# Altium schematic sheet Main.SchDoc
size A2; SheetNumber: 1; SheetTotal: 3
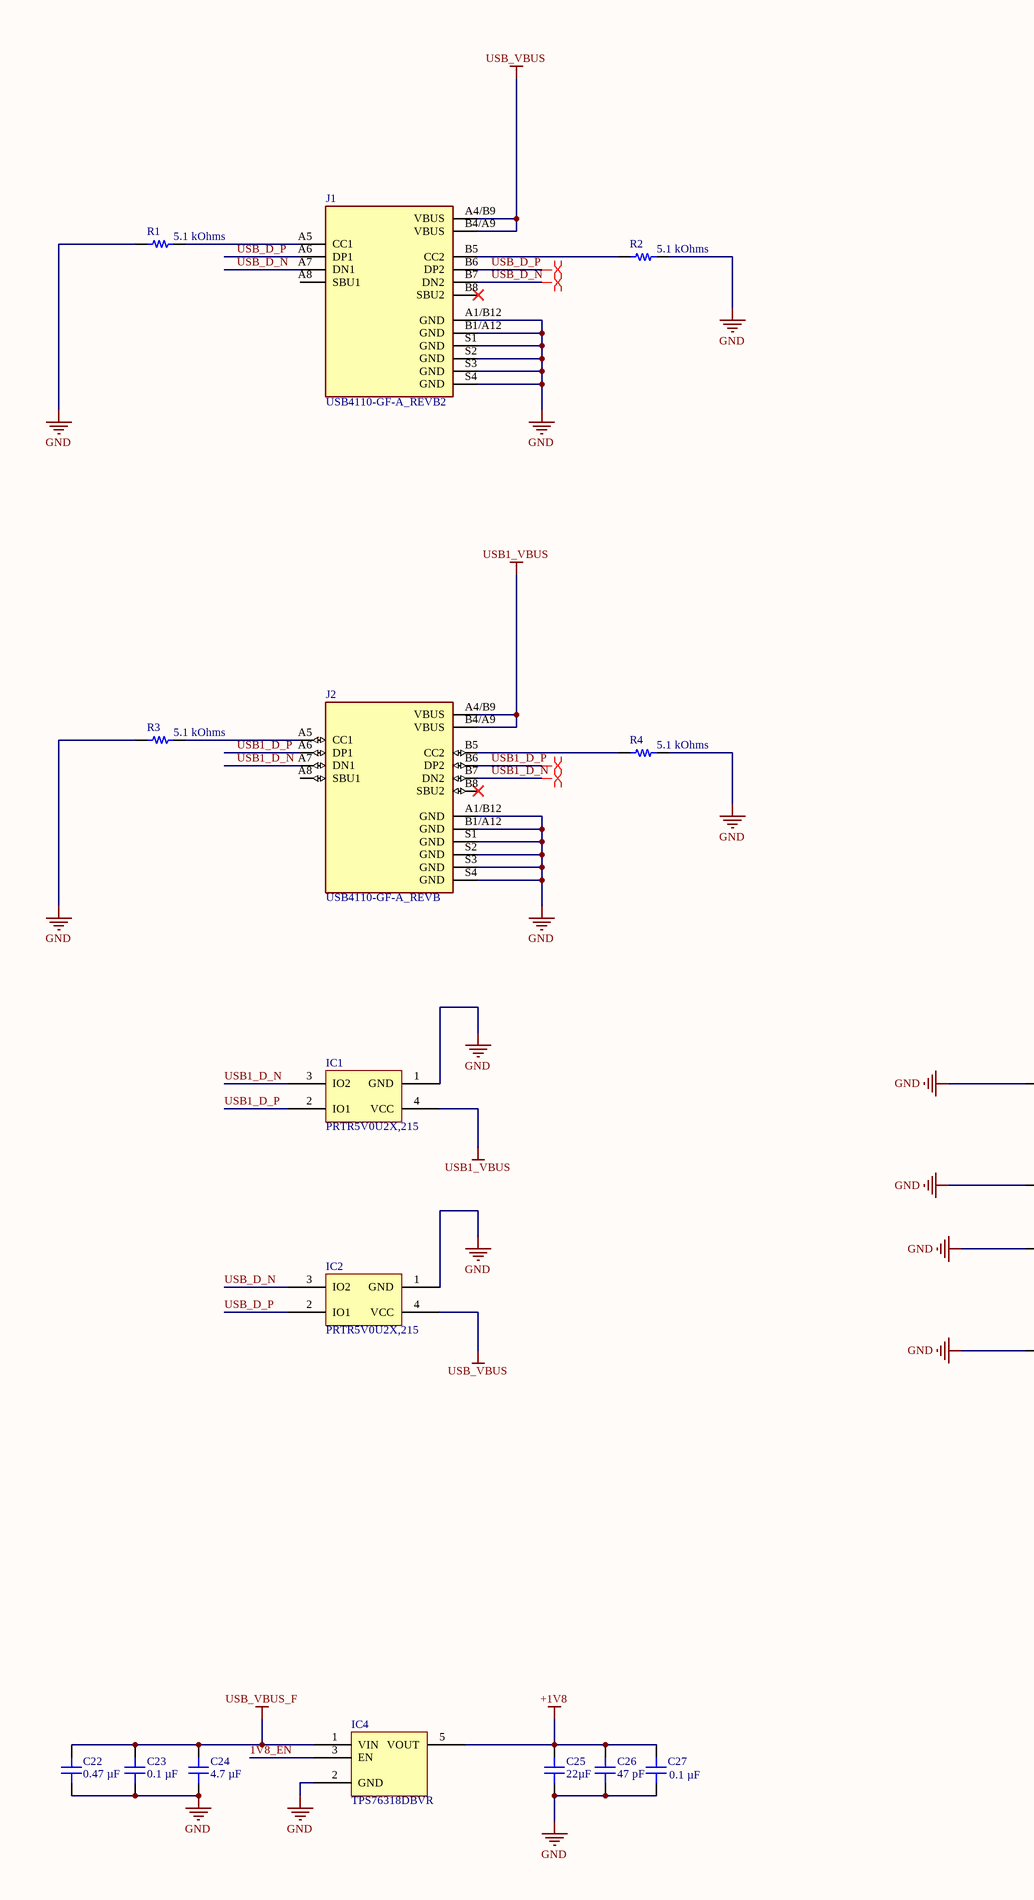
[diagram p0: Main.SchDoc, left]
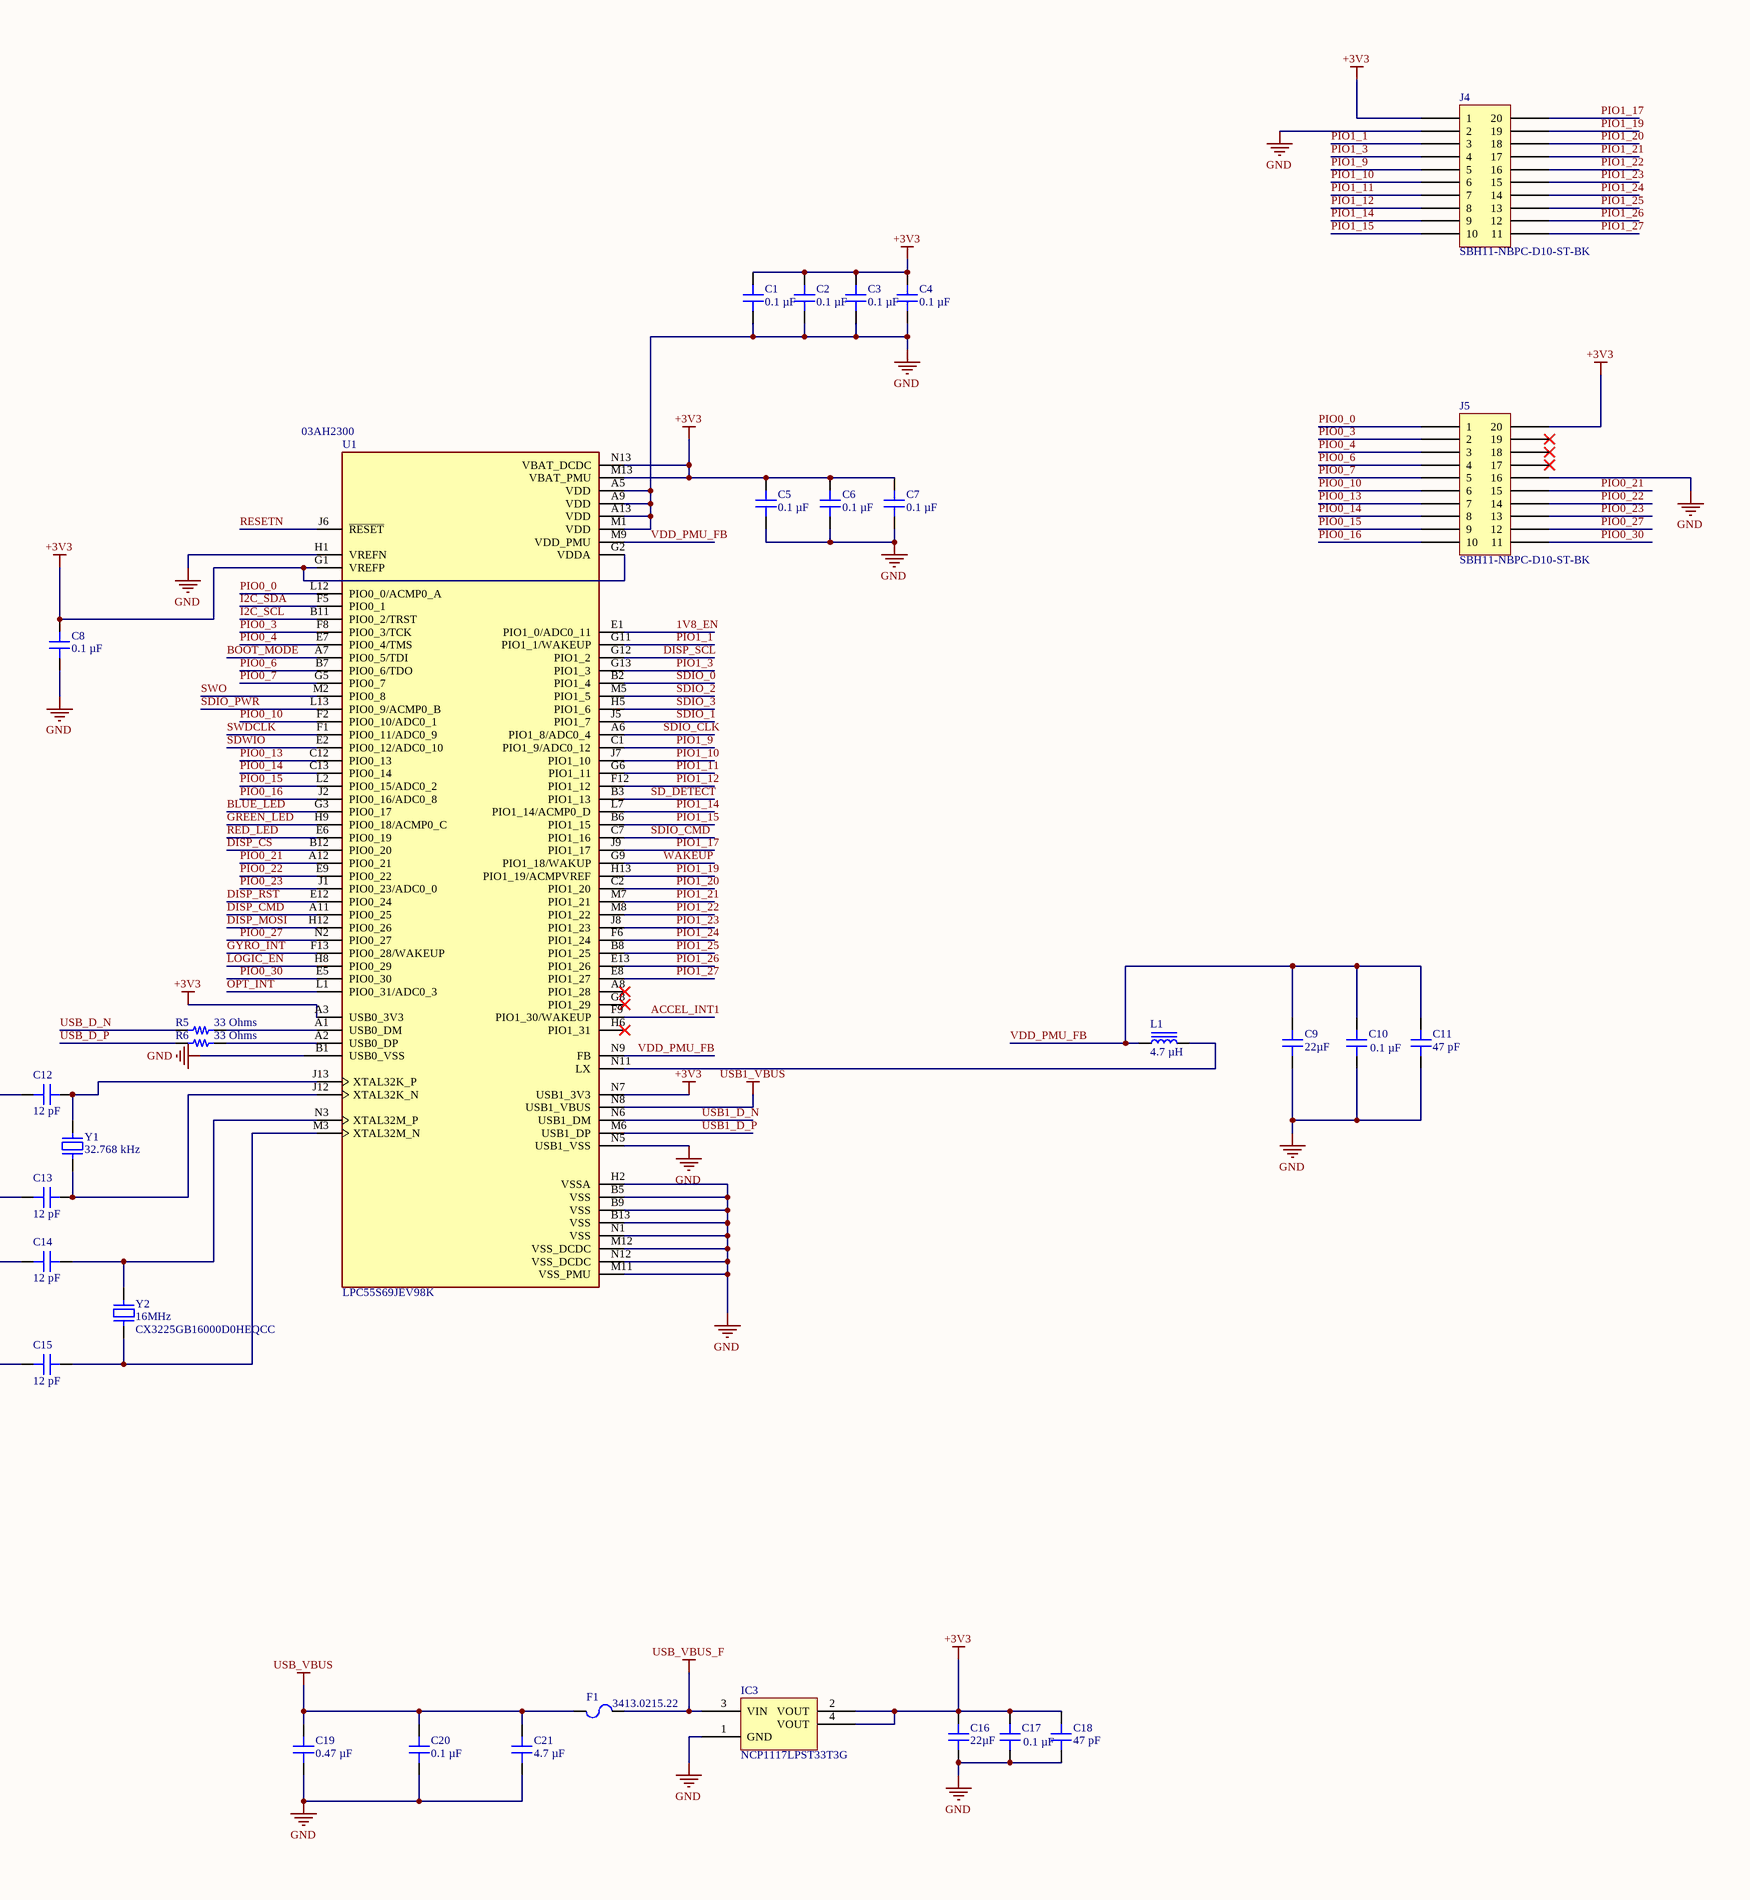
[diagram p1: Main.SchDoc, right]

## Parts
C1  0.1 µF  [CAP 0603_1608]
C2  0.1 µF  [CAP 0603_1608]
C3  0.1 µF  [CAP 0603_1608]
C4  0.1 µF  [CAP 0603_1608]
C5  0.1 µF  [CAP 0603_1608]
C6  0.1 µF  [CAP 0603_1608]
C7  0.1 µF  [CAP 0603_1608]
C8  0.1 µF  [CAP 0603_1608]
C9  22µF  [CAP 0603_1608]
C10  0.1 µF  [CAP 0603_1608]
C11  47 pF  [CAP 0603_1608]
C12  12 pF  [CAP 0603_1608]
C13  12 pF  [CAP 0603_1608]
C14  12 pF  [CAP 0603_1608]
C15  12 pF  [CAP 0603_1608]
C16  22µF  [CAP 0603_1608]
C17  0.1 µF  [CAP 0603_1608]
C18  47 pF  [CAP 0603_1608]
C19  0.47 µF  [CAP 0603_1608]
C20  0.1 µF  [CAP 0603_1608]
C21  4.7 µF  [CAP 0603_1608]
C22  0.47 µF  [CAP 0603_1608]
C23  0.1 µF  [CAP 0603_1608]
C24  4.7 µF  [CAP 0603_1608]
C25  22µF  [CAP 0603_1608]
C26  47 pF  [CAP 0603_1608]
C27  0.1 µF  [CAP 0603_1608]
F1  3413.0215.22  [FUSE 1206_3216 0.6MM]
IC1  PRTR5V0U2X,215  [SOT143B]
IC2  PRTR5V0U2X,215  [SOT143B]
IC3  NCP1117LPST33T3G  [ON SEMI SOT-223 ST(318H)]
IC4  TPS76318DBVR  [TI SOT-23-5 DBV]
J1  USB4110-GF-A_REVB2  [USBNew]
J2  USB4110-GF-A_REVB  [GCT_USB4110-GF-A_REVB]
J4  SBH11-NBPC-D10-ST-BK  [SULLINS SBH11-NBPC-D10-ST-BK]
J5  SBH11-NBPC-D10-ST-BK  [SULLINS SBH11-NBPC-D10-ST-BK]
L1  4.7 µH  [TDK VLS252012CX]
R1  5.1 kOhms  [RES 0603_1608]
R2  5.1 kOhms  [RES 0603_1608]
R3  5.1 kOhms  [RES 0603_1608]
R4  5.1 kOhms  [RES 0603_1608]
R5  33 Ohms  [RES 0603_1608]
R6  33 Ohms  [RES 0603_1608]
U1  LPC55S69JEV98K  Supplier Part Number 1: 03AH2300  [IC_LPC55S69JEV98K]
Y1  32.768 kHz  [ABRACON ABS06]
Y2  16MHz  Part Number: CX3225GB16000D0HEQCC  [KYOCERA CX3225GB]

## Nets
+1V8: C25.1 C26.2 C27.2 IC4.5(VOUT)
+3V3: C1.2 C2.2 C3.2 C4.2 C5.2 C6.2 C7.2 C8.2 C16.1 C17.2 C18.2 IC3.2(VOUT) IC3.4(VOUT) J4.1 J5.20 U1.A3(USB0_3V3) U1.G1(VREFP) U1.G2(VDDA) U1.M13(VBAT_PMU) U1.N7(USB1_3V3) U1.N13(VBAT_DCDC)
GND: C1.1 C2.1 C3.1 C4.1 C5.1 C6.1 C7.1 C8.1 C9.2 C10.1 C11.1 C12.2 C13.2 C14.2 C15.2 C16.2 C17.1 C18.1 C19.1 C20.1 C21.1 C22.1 C23.1 C24.1 C25.2 C26.1 C27.1 IC1.1(GND) IC2.1(GND) IC3.1(GND) IC4.2(GND) J1.A1/B12(GND) J1.B1/A12(GND) J1.S1(GND) J1.S2(GND) J1.S3(GND) J1.S4(GND) J2.A1/B12(GND) J2.B1/A12(GND) J2.S1(GND) J2.S2(GND) J2.S3(GND) J2.S4(GND) J4.2 J5.16 R1.1 R2.2 R3.1 R4.2 U1.A5(VDD) U1.A9(VDD) U1.A13(VDD) U1.B1(USB0_VSS) U1.B5(VSS) U1.B9(VSS) U1.B13(VSS) U1.H1(VREFN) U1.H2(VSSA) U1.M1(VDD) U1.M11(VSS_PMU) U1.M12(VSS_DCDC) U1.N1(VSS) U1.N5(USB1_VSS) U1.N12(VSS_DCDC)
USB1_VBUS: IC1.4(VCC) J2.A4/B9(VBUS) J2.B4/A9(VBUS) U1.N8(USB1_VBUS)
USB_VBUS: C19.2 C20.2 C21.2 F1.1 IC2.4(VCC) J1.A4/B9(VBUS) J1.B4/A9(VBUS)
USB_VBUS_F: C22.2 C23.2 C24.2 F1.2 IC3.3(VIN) IC4.1(VIN)
1V8_EN: IC4.3(EN) U1.E1(PIO1_0/ADC0_11)
ACCEL_INT1: U1.F9(PIO1_30/WAKEUP)
BLUE_LED: U1.G3(PIO0_17)
BOOT_MODE: U1.A7(PIO0_5/TDI)
DISP_CMD: U1.A11(PIO0_25)
DISP_CS: U1.B12(PIO0_20)
DISP_MOSI: U1.H12(PIO0_26)
DISP_RST: U1.E12(PIO0_24)
DISP_SCL: U1.G12(PIO1_2)
GREEN_LED: U1.H9(PIO0_18/ACMP0_C)
GYRO_INT: U1.F13(PIO0_28/WAKEUP)
I2C_SCL: U1.B11(PIO0_2/TRST)
I2C_SDA: U1.F5(PIO0_1)
LOGIC_EN: U1.H8(PIO0_29)
OPT_INT: U1.L1(PIO0_31/ADC0_3)
PIO0_0: J5.1 U1.L12(PIO0_0/ACMP0_A)
PIO0_3: J5.2 U1.F8(PIO0_3/TCK)
PIO0_4: J5.3 U1.E7(PIO0_4/TMS)
PIO0_6: J5.4 U1.B7(PIO0_6/TDO)
PIO0_7: J5.5 U1.G5(PIO0_7)
PIO0_10: J5.6 U1.F2(PIO0_10/ADC0_1)
PIO0_13: J5.7 U1.C12(PIO0_13)
PIO0_14: J5.8 U1.C13(PIO0_14)
PIO0_15: J5.9 U1.L2(PIO0_15/ADC0_2)
PIO0_16: J5.10 U1.J2(PIO0_16/ADC0_8)
PIO0_21: J5.15 U1.A12(PIO0_21)
PIO0_22: J5.14 U1.E9(PIO0_22)
PIO0_23: J5.13 U1.J1(PIO0_23/ADC0_0)
PIO0_27: J5.12 U1.N2(PIO0_27)
PIO0_30: J5.11 U1.E5(PIO0_30)
PIO1_1: J4.3 U1.G11(PIO1_1/WAKEUP)
PIO1_3: J4.4 U1.G13(PIO1_3)
PIO1_9: J4.5 U1.C1(PIO1_9/ADC0_12)
PIO1_10: J4.6 U1.J7(PIO1_10)
PIO1_11: J4.7 U1.G6(PIO1_11)
PIO1_12: J4.8 U1.F12(PIO1_12)
PIO1_14: J4.9 U1.L7(PIO1_14/ACMP0_D)
PIO1_15: J4.10 U1.B6(PIO1_15)
PIO1_17: J4.20 U1.J9(PIO1_17)
PIO1_19: J4.19 U1.H13(PIO1_19/ACMPVREF)
PIO1_20: J4.18 U1.C2(PIO1_20)
PIO1_21: J4.17 U1.M7(PIO1_21)
PIO1_22: J4.16 U1.M8(PIO1_22)
PIO1_23: J4.15 U1.J8(PIO1_23)
PIO1_24: J4.14 U1.F6(PIO1_24)
PIO1_25: J4.13 U1.B8(PIO1_25)
PIO1_26: J4.12 U1.E13(PIO1_26)
PIO1_27: J4.11 U1.E8(PIO1_27)
RED_LED: U1.E6(PIO0_19)
RESETN: U1.J6(~{RESET})
SD_DETECT: U1.B3(PIO1_13)
SDIO_0: U1.B2(PIO1_4)
SDIO_1: U1.J5(PIO1_7)
SDIO_2: U1.M5(PIO1_5)
SDIO_3: U1.H5(PIO1_6)
SDIO_CLK: U1.A6(PIO1_8/ADC0_4)
SDIO_CMD: U1.C7(PIO1_16)
SDIO_PWR: U1.L13(PIO0_9/ACMP0_B)
SDWIO: U1.E2(PIO0_12/ADC0_10)
SWDCLK: U1.F1(PIO0_11/ADC0_9)
SWO: U1.M2(PIO0_8)
USB1_D_N: IC1.3(IO2) J2.A7(DN1) J2.B7(DN2) U1.N6(USB1_DM)
USB1_D_P: IC1.2(IO1) J2.A6(DP1) J2.B6(DP2) U1.M6(USB1_DP)
USB_D_N: IC2.3(IO2) J1.A7(DN1) J1.B7(DN2) R5.1
USB_D_P: IC2.2(IO1) J1.A6(DP1) J1.B6(DP2) R6.1
VDD_PMU_FB: C9.1 C10.2 C11.2 L1.1 U1.M9(VDD_PMU) U1.N9(FB)
WAKEUP: U1.G9(PIO1_18/WAKUP)
NetC12_1: C12.1 U1.J13(XTAL32K_P) Y1.2
NetC13_1: C13.1 U1.J12(XTAL32K_N) Y1.1
NetC14_1: C14.1 U1.N3(XTAL32M_P) Y2.1
NetC15_1: C15.1 U1.M3(XTAL32M_N) Y2.3
NetJ1_A5: J1.A5(CC1) R1.2
NetJ1_B5: J1.B5(CC2) R2.1
NetJ2_A5: J2.A5(CC1) R3.2
NetJ2_B5: J2.B5(CC2) R4.1
NetL1_2: L1.2 U1.N11(LX)
NetR5_2: R5.2 U1.A1(USB0_DM)
NetR6_2: R6.2 U1.A2(USB0_DP)

Not connected (* = marked no-connect by the designer): J1 A8(SBU1) B8(SBU2)*; J2 A8(SBU1) B8(SBU2)*; J5 17* 18* 19*; U1 A8(PIO1_28)* G8(PIO1_29)* H6(PIO1_31)*

## Layout directives
differential pair: USB1_D_N, USB1_D_P, USB_D_N, USB_D_P

## Library data of the parts
C1-C8 C10 C17 C20 C23 C27 = CS0603KRX7R7BB104: CAP CER 0.1UF 16V X7R 0603; manufacturer: Yageo; Tolerance: ±10%; Part Number: CS0603KRX7R7BB104; Value: 0.1 µF; Applications: Boardflex Sensitive; Capacitance: 0.1 µF; componentlink1description: Datasheet; componentlink1url: http://www.yageo.com/NewPortal/yageodocoutput?fileName=/pdf/MLCC/UPY-ST_NPOX7R_16V-to-3KV_5.pdf; componentlink2description: DigiKey Link; componentlink2url: https://www.digikey.com/en/products/detail/yageo/CS0603KRX7R7BB104/6097897; Device Package: 0603 (1608 Metric); Features: Soft Termination; lastupdated: 12.06.2022 00:52:33; Lifecycle Status: Active; Minimum Order: 1; Mounting Type: Surface Mount, MLCC; Operating Temperature: -55°C ~ 125°C; Package / Case: 0603 (1608 Metric); packaging: TapeAndReel; partid: 2286; Part Status: Active; price: 0.02; series: CS; Size / Dimension: 0.063" L x 0.031" W (1.60mm x 0.80mm); Supplier 1: DigiKey; Supplier Part Number 1: 311-3560-1-ND; Temperature Coefficient: X7R; Thickness (Max): 0.037" (0.95mm); Voltage - Rated: 16V
C9 C16 C25 = 06036D226MAT2A: CAP CER 22UF 6.3V X5R 0603; manufacturer: AVX Corporation; Tolerance: ±20%; Part Number: 06036D226MAT2A; Value: 22µF; Applications: General Purpose; Capacitance: 22µF; componentlink1description: Datasheet; componentlink1url: http://datasheets.avx.com/cx5r.pdf; componentlink2description: DigiKey Link; componentlink2url: http://digikey.com/product-detail/en/avx-corporation/06036D226MAT2A/478-10812-1-ND/7536349; Device Package: 0603 (1608 Metric); lastupdated: 2.09.2020 01:03:16; Lifecycle Status: Active; Minimum Order: 1; Mounting Type: Surface Mount, MLCC; Operating Temperature: -55°C ~ 85°C; Package / Case: 0603 (1608 Metric); packaging: TapeAndReel; partid: 13180; Part Status: Active; price: 0.10; series: -; Size / Dimension: 0.063" L x 0.032" W (1.60mm x 0.81mm); Supplier 1: DigiKey; Supplier Part Number 1: 478-10812-1-ND; Temperature Coefficient: X5R; Thickness (Max): 0.040" (1.02mm); Voltage - Rated: 6.3V
C11 C18 C26 = C0603C470J3GACAUTO: CAP CER 47PF 25V C0G/NP0 0603; manufacturer: KEMET; Temperature Coefficient: C0G, NP0; Tolerance: ±5%; Part Number: C0603C470J3GACAUTO; Value: 47 pF; Applications: Automotive; Capacitance: 47 pF; componentlink1description: Datasheet; componentlink1url: https://api.kemet.com/component-edge/download/datasheet/C0603C470J3GACAUTO.pdf; componentlink2description: DigiKey Link; componentlink2url: https://www.digikey.com/en/products/detail/kemet/C0603C470J3GACAUTO/3314884; Device Package: 0603 (1608 Metric); Features: Low ESL; lastupdated: 12.06.2022 00:51:55; Lifecycle Status: Active; Minimum Order: 1; Mounting Type: Surface Mount, MLCC; Operating Temperature: -55°C ~ 125°C; Package / Case: 0603 (1608 Metric); packaging: TapeAndReel; partid: 15056; Part Status: Active; price: 0.02; Ratings: AEC-Q200; series: SMD Auto C0G; Size / Dimension: 0.063" L x 0.031" W (1.60mm x 0.80mm); Supplier 1: DigiKey; Supplier Part Number 1: 399-6889-1-ND; Thickness (Max): 0.034" (0.87mm); Voltage - Rated: 25V
C12-C15 = CC0603GRNPO9BN120: CAP CER 12PF 50V C0G/NPO 0603; manufacturer: Yageo; Temperature Coefficient: C0G, NP0; Tolerance: ±2%; Part Number: CC0603GRNPO9BN120; Value: 12 pF; Applications: General Purpose; Capacitance: 12 pF; componentlink1description: Datasheet; componentlink1url: https://www.yageo.com/upload/media/product/productsearch/datasheet/mlcc/UPY-GP_NP0_16V-to-50V_17.pdf; componentlink2description: DigiKey Link; componentlink2url: https://www.digikey.com/en/products/detail/yageo/CC0603GRNPO9BN120/5883540; Device Package: 0603 (1608 Metric); lastupdated: 14.06.2022 20:58:18; Lifecycle Status: Active; Minimum Order: 1; Mounting Type: Surface Mount, MLCC; Operating Temperature: -55°C ~ 125°C; Package / Case: 0603 (1608 Metric); packaging: TapeAndReel; partid: 3692; Part Status: Active; price: 0.02; series: CC; Size / Dimension: 0.063" L x 0.031" W (1.60mm x 0.80mm); Supplier 1: DigiKey; Supplier Part Number 1: 311-3917-1-ND; Thickness (Max): 0.035" (0.90mm); Voltage - Rated: 50V
C19 C22 = CC0603KRX5R6BB474: CAP CER 0.47UF 10V X5R 0603; manufacturer: Yageo; Tolerance: ±10%; Part Number: CC0603KRX5R6BB474; Value: 0.47 µF; Applications: General Purpose; Capacitance: 0.47 µF; componentlink1description: Datasheet; componentlink1url: https://www.yageo.com/upload/media/product/productsearch/datasheet/mlcc/UPY-GPHC_X5R_4V-to-50V_25.pdf; componentlink2description: DigiKey Link; componentlink2url: https://www.digikey.com/en/products/detail/yageo/CC0603KRX5R6BB474/2345079; Device Package: 0603 (1608 Metric); lastupdated: 12.06.2022 00:52:33; Lifecycle Status: Active; Minimum Order: 1; Mounting Type: Surface Mount, MLCC; Operating Temperature: -55°C ~ 85°C; Package / Case: 0603 (1608 Metric); packaging: TapeAndReel; partid: 2283; Part Status: Active; price: 0.02; series: CC; Size / Dimension: 0.063" L x 0.031" W (1.60mm x 0.80mm); Supplier 1: DigiKey; Supplier Part Number 1: 311-1783-1-ND; Temperature Coefficient: X5R; Thickness (Max): 0.035" (0.90mm); Voltage - Rated: 10V
C21 C24 = GRM188C71A475KE11D: CAP CER 4.7UF 10V X7S 0603; manufacturer: Murata Electronics; Tolerance: ±10%; Part Number: GRM188C71A475KE11D; Value: 4.7 µF; Applications: General Purpose; Capacitance: 4.7 µF; componentlink1description: Datasheet; componentlink1url: https://search.murata.co.jp/Ceramy/image/img/A01X/G101/ENG/GRM188C71A475KE11-01.pdf; componentlink2description: DigiKey Link; componentlink2url: https://www.digikey.com/en/products/detail/murata-electronics/GRM188C71A475KE11D/4905309; Device Package: 0603 (1608 Metric); lastupdated: 12.06.2022 00:52:33; Lifecycle Status: Active; Minimum Order: 1; Mounting Type: Surface Mount, MLCC; Operating Temperature: -55°C ~ 125°C; Package / Case: 0603 (1608 Metric); packaging: TapeAndReel; partid: 2397; Part Status: Active; price: 0.05; series: GRM; Size / Dimension: 0.063" L x 0.031" W (1.60mm x 0.80mm); Supplier 1: DigiKey; Supplier Part Number 1: 490-11992-1-ND; Temperature Coefficient: X7S; Thickness (Max): 0.037" (0.95mm); Voltage - Rated: 10V
F1 = 3413.0215.22: FUSE BOARD MNT 800MA 32VAC 63VDC; Manufacturer: Schurter Inc.; Approval Agency: cURus, VDE; Breaking Capacity @ Rated Voltage: 63A; Fuse Type: Board Mount (Cartridge Style Excluded); Melting I²t: 0.18; Response Time: Fast Blow; Voltage Rating - AC: 32V; Voltage Rating - DC: 63V; Part Number: 3413.0215.22; Approvals: cURus, VDE; ComponentLink1Description: Datasheet; ComponentLink1URL: https://us.schurter.com/pdf/english/typ_USI_1206.pdf; ComponentLink2Description: DigiKey Link; ComponentLink2URL: http://digikey.com/product-detail/en/schurter-inc/3413.0215.22/486-1143-1-ND/1522975; Current Rating (Amps): 800mA; Device Package: 1206 (3216 Metric); LastUpdated: 2.09.2020 01:30:41; Lifecycle Status: Active; Minimum Order: 1; Mounting Type: Surface Mount; Operating Temperature: -55°C ~ 90°C; Package / Case: 1206 (3216 Metric); Packaging: TapeAndReel; Part Status: Active; Price: 0.26; Series: USI 1206; Size / Dimension: 0.126" L x 0.063" W x 0.024" H (3.20mm x 1.60mm x 0.60mm); Supplier 1: DigiKey; Supplier Part Number 1: 486-1143-1-ND
IC1 IC2 = PRTR5V0U2X,215: TVS DIODE 5.5V SOT143B; Manufacturer: Nexperia USA Inc.; Capacitance @ Frequency: 1pF @ 1MHz; Power Line Protection: Yes; Unidirectional Channels: 2; Voltage - Breakdown (Min): 6V; Voltage - Reverse Standoff (Typ): 5.5V (Max); Part Number: PRTR5V0U2X,215; Applications: General Purpose; ComponentLink1Description: Datasheet; ComponentLink1URL: https://assets.nexperia.com/documents/data-sheet/PRTR5V0U2X.pdf; ComponentLink2Description: DigiKey Link; ComponentLink2URL: //digikey.com/product-detail/en/nexperia-usa-inc/PRTR5V0U2X215/1727-3884-2-ND/1163690; Device Package: TO-253-4, TO-253AA; LastUpdated: 9.12.2019 21:29:05; Lifecycle Status: 0; Minimum Order: 1; Mounting Type: Surface Mount; Operating Temperature: -40°C ~ 85°C (TA); Package / Case: TO-253-4, TO-253AA; Packaging: TapeAndReel; PartId: 5451; Part Status: Active; Price: 0.18; Series: -; Supplier 1: DigiKey; Supplier Part Number 1: 1727-3884-2-ND; Supplier Device Package: SOT-143B; Type: Steering (Rail to Rail)
IC3 = NCP1117LPST33T3G: IC REG LINEAR 3.3V 1A SOT223; Manufacturer: ON Semiconductor; Current - Quiescent (Iq): 700µA; Number of Regulators: 1; Output Configuration: Positive; Output Type: Fixed; Protection Features: Over Current, Over Temperature; PSRR: 60dB (120Hz); Voltage Dropout (Max): 1.4V @ 1A; Voltage - Input (Max): 18V; Part Number: NCP1117LPST33T3G; ComponentLink1Description: Datasheet; ComponentLink1URL: http://www.onsemi.com/pub/Collateral/NCP1117LP-D.PDF; ComponentLink2Description: DigiKey Link; ComponentLink2URL: http://digikey.com/product-detail/en/on-semiconductor/NCP1117LPST33T3G/NCP1117LPST33T3GOSCT-ND/3462387; Current - Output: 1A; LastUpdated: 12.06.2022 01:44:12; Lifecycle Status: Active; Minimum Order: 1; Mounting Type: Surface Mount; Package / Case: TO-261-4, TO-261AA; Packaging: TapeAndReel; Part Status: Active; Price: 0.12; Series: -; Supplier 1: DigiKey; Supplier Part Number 1: NCP1117LPST33T3GOSCT-ND; Supplier Device Package: SOT-223; Voltage - Output (Min/Fixed): 3.3V
IC4 = TPS76318DBVR: IC REG LINEAR 1.8V 150MA SOT23-5; Manufacturer: Texas Instruments; Control Features: Enable; Current - Quiescent (Iq): 100 µA; Current - Supply (Max): 140 µA; Number of Regulators: 1; Output Configuration: Positive; Output Type: Fixed; Protection Features: Over Current, Over Temperature, Reverse Polarity; PSRR: 60dB (1kHz); Voltage - Input (Max): 10V; Part Number: TPS76318DBVR; ComponentLink1Description: Datasheet; ComponentLink1URL: http://www.ti.com/general/docs/suppproductinfo.tsp?distId=10&gotoUrl=http%3A%2F%2Fwww.ti.com%2Flit%2Fgpn%2Ftps763; ComponentLink2Description: DigiKey Link; ComponentLink2URL: https://www.digikey.com/en/products/detail/texas-instruments/TPS76318DBVR/382161; Current - Output: 150mA; LastUpdated: 16.06.2022 11:30:59; Lifecycle Status: Active; Minimum Order: 1; Mounting Type: Surface Mount; Operating Temperature: -40°C ~ 125°C; Package / Case: SC-74A, SOT-753; Packaging: TapeAndReel; Part Status: Active; Price: 0.43; Series: -; Supplier 1: DigiKey; Supplier Part Number 1: 296-11016-1-ND; Supplier Device Package: SOT-23-5; Voltage - Output (Min/Fixed): 1.8V
J1 J2 = USB4110-GF-A_REVB: USB; Value: *; Availability: Unavailable; Price: None; Package: None; MP: USB4110-GF-A_REVB
  J2: ComponentLink1Description: New link; ComponentLink1URL: *
J4 J5 = SBH11-NBPC-D10-ST-BK: CONN HEADER VERT 20POS 2.54MM; Manufacturer: Sullins Connector Solutions; Current Rating (Amps): 3A; Material Flammability Rating: UL94 V-0; Number of Positions: 20; Number of Positions Loaded: All; Shrouding: Shrouded - 4 Wall; Style: Board to Board or Cable; Part Number: SBH11-NBPC-D10-ST-BK; ComponentLink1Description: Datasheet; ComponentLink1URL: https://s3.amazonaws.com/catalogspreads-pdf/PAGE122%20.100%20SBH11%20SERIES%20MALE%20BOX%20HDR%20ST%20RA%20SMT.pdf; ComponentLink2Description: DigiKey Link; ComponentLink2URL: http://digikey.com/product-detail/en/sullins-connector-solutions/SBH11-NBPC-D10-ST-BK/SBH11-NBPC-D10-ST-BK-ND/4558585; Connector Type: Header; Contact Finish - Mating: Gold; Contact Finish - Post: Gold; Contact Finish Thickness - Mating: Flash; Contact Material: Brass; Contact Shape: Square; Contact Type: Male Pin; Fastening Type: Push-Pull; Features: Keying Slot; Insulation Color: Black; Insulation Material: Polyamide (PA), Nylon; LastUpdated: 21.06.2022 14:45:11; Lifecycle Status: Active; Minimum Order: 1000; Mounting Type: Through Hole; Number of Rows: 2; Operating Temperature: -40°C ~ 105°C; Packaging: Tray; PartId: 135; Part Status: Active; Price: 0.40; Series: SBH11; Supplier 1: DigiKey; Supplier Part Number 1: SBH11-NBPC-D10-ST-BK-ND; Termination: Solder
L1 = VLS252012CX-4R7M-1: FIXED IND 4.7UH 1.24A 210MOHM SM; Manufacturer: TDK Corporation; Current - Saturation: 1.1A; DC Resistance (DCR): 210mOhm Max; Inductance Frequency - Test: 1 MHz; Material - Core: Ferrite; Shielding: Shielded; Tolerance: ±20%; Type: Wirewound; Part Number: VLS252012CX-4R7M-1; ComponentLink1Description: Datasheet; ComponentLink1URL: https://product.tdk.com/info/en/catalog/datasheets/inductor_commercial_power_vls252012cx-1_en.pdf?ref_disty=digikey; ComponentLink2Description: DigiKey Link; ComponentLink2URL: https://www.digikey.com/en/products/detail/tdk-corporation/VLS252012CX-4R7M-1/5169790; Current Rating (Amps): 1.24 A; Device Package: Nonstandard; Height - Seated (Max): 0.047" (1.20mm); Inductance: 4.7 µH; LastUpdated: 12.06.2022 01:37:54; Lifecycle Status: Active; Minimum Order: 1; Mounting Type: Surface Mount; Operating Temperature: -40°C ~ 105°C; Package / Case: Nonstandard; Packaging: TapeAndReel; PartId: 228; Part Status: Active; Price: 0.16; Series: VLS-CX-1; Size / Dimension: 0.098" L x 0.079" W (2.50mm x 2.00mm); Supplier 1: DigiKey; Supplier Part Number 1: 445-172985-1-ND; Supplier Device Package: 2520; Value: 4.7 µH
R1-R4 = AC0603JR-075K1L: RES SMD 5.1K OHM 5% 1/10W 0603; Manufacturer: Yageo; Power (Watts): 0.1W, 1/10W; Temperature Coefficient: ±100ppm/°C; Part Number: AC0603JR-075K1L; Value: 5.1 kOhms; ComponentLink1Description: Datasheet; ComponentLink1URL: https://www.yageo.com/upload/media/product/productsearch/datasheet/rchip/PYu-AC_51_RoHS_L_7.pdf; ComponentLink2Description: DigiKey Link; ComponentLink2URL: https://www.digikey.com/en/products/detail/yageo/AC0603JR-075K1L/5896480; Composition: Thick Film; Device Package: 0603 (1608 Metric); Features: Automotive AEC-Q200, Moisture Resistant; Height - Seated (Max): 0.022" (0.55mm); LastUpdated: 12.06.2022 01:11:56; Lifecycle Status: Active; Minimum Order: 1; Number of Terminations: 2; Operating Temperature: -55°C ~ 155°C; Package / Case: 0603 (1608 Metric); Packaging: CutTape; PartId: 8336; Part Status: Active; Price: 0.01; Ratings: AEC-Q200; Resistance: 5.1 kOhms; Series: AC; Size / Dimension: 0.063" L x 0.031" W (1.60mm x 0.80mm); Supplier 1: DigiKey; Supplier Part Number 1: YAG3682CT-ND; Supplier Device Package: 0603; Tolerance: ±5%
R5 R6 = AC0603FR-0733RL: RES SMD 33 OHM 1% 1/10W 0603; Manufacturer: Yageo; Power (Watts): 0.1W, 1/10W; Temperature Coefficient: ±100ppm/°C; Part Number: AC0603FR-0733RL; Value: 33 Ohms; ComponentLink1Description: Datasheet; ComponentLink1URL: https://www.yageo.com/upload/media/product/productsearch/datasheet/rchip/PYu-AC_51_RoHS_L_7.pdf; ComponentLink2Description: DigiKey Link; ComponentLink2URL: https://www.digikey.com/en/products/detail/yageo/AC0603FR-0733RL/5896043; Composition: Thick Film; Device Package: 0603 (1608 Metric); Features: Automotive AEC-Q200, Moisture Resistant; Height - Seated (Max): 0.022" (0.55mm); LastUpdated: 18.06.2022 06:13:30; Lifecycle Status: Active; Minimum Order: 1; Number of Terminations: 2; Operating Temperature: -55°C ~ 155°C; Package / Case: 0603 (1608 Metric); Packaging: CutTape; PartId: 17381; Part Status: Active; Price: 0.01; Ratings: AEC-Q200; Resistance: 33 Ohms; Series: AC; Size / Dimension: 0.063" L x 0.031" W (1.60mm x 0.80mm); Supplier 1: DigiKey; Supplier Part Number 1: YAG3599CT-ND; Supplier Device Package: 0603; Tolerance: ±1%
U1 = LPC55S69JEV98K: MCU 32-bit ARM Cortex M33 RISC 640KB Flash 3.3V 98-Pin VFBGA Tray; MF: NXP Semiconductors; Availability: In Stock; Purchase-URL: https://pricing.snapeda.com/search/part/LPC55S69JEV98K/?ref=eda; SnapEDA_Link: https://www.snapeda.com/parts/LPC55S69JEV98K/Nexperia/view-part/?ref=snap; Price: None; Check_prices: https://www.snapeda.com/parts/LPC55S69JEV98K/Nexperia/view-part/?ref=eda; Package: None; MP: LPC55S69JEV98K; Value: *; Supplier 1: Newark
Y1 = ABS06-32.768KHZ-1-T: CRYSTAL 32.7680KHZ 12.5PF SMD; Manufacturer: Abracon LLC; ESR (Equivalent Series Resistance): 90 kOhms; Frequency Tolerance: ±10ppm; Operating Mode: Fundamental; Part Number: ABS06-32.768KHZ-1-T; ComponentLink1Description: Datasheet; ComponentLink1URL: https://abracon.com/Resonators/ABS06.pdf; ComponentLink2Description: DigiKey Link; ComponentLink2URL: https://www.digikey.com/en/products/detail/abracon-llc/ABS06-32-768KHZ-1-T/2217994; Frequency: 32.768 kHz; Height - Seated (Max): 0.024" (0.60mm); LastUpdated: 29.06.2022 14:39:54; Lifecycle Status: Active; Load Capacitance: 12.5pF; Minimum Order: 1; Mounting Type: Surface Mount; Operating Temperature: -40°C ~ 85°C; Package / Case: 2-SMD, No Lead; Packaging: TapeAndReel; PartId: 370; Part Status: Active; Price: 0.94; Series: ABS06; Size / Dimension: 0.079" L x 0.047" W (2.00mm x 1.20mm); Supplier 1: DigiKey; Supplier Part Number 1: 535-10248-1-ND; Type: kHz Crystal (Tuning Fork); Value: 32.768 kHz
Y2 = CX3225GB16000D0HEQCC: CRYSTAL 16.0000MHZ 8PF SMD; Manufacturer: Kyocera International Inc. Electronic Components; ESR (Equivalent Series Resistance): 80 Ohms; Frequency Stability: ±30ppm; Frequency Tolerance: ±20ppm; Operating Mode: Fundamental; ComponentLink1Description: Datasheet; ComponentLink1URL: //media.digikey.com/pdf/Data%20Sheets/AVX%20PDFs/CX3225GBxD0HEQ_Series_Spec.pdf; ComponentLink2Description: DigiKey Link; ComponentLink2URL: http://digikey.com/product-detail/en/kyocera-international-inc-electronic-components/CX3225GB16000D0HEQCC/1253-1180-1-ND/4453986; Frequency: 16MHz; Height - Seated (Max): 0.035" (0.90mm); LastUpdated: 14.06.2022 21:42:53; Lifecycle Status: Active; Load Capacitance: 8pF; Minimum Order: 1; Mounting Type: Surface Mount; Operating Temperature: -10°C ~ 70°C; Package / Case: 4-SMD, No Lead; Packaging: TapeAndReel; PartId: 485; Part Status: Active; Price: 0.33; Series: CX3225GB, Kyocera; Size / Dimension: 0.126" L x 0.098" W (3.20mm x 2.50mm); Supplier 1: DigiKey; Supplier Part Number 1: 1253-1180-1-ND; Type: MHz Crystal; Value: 16MHz